# EAGLE design ESP32-TrackerREV3_PCBWAY (EAGLE 9.5.2)
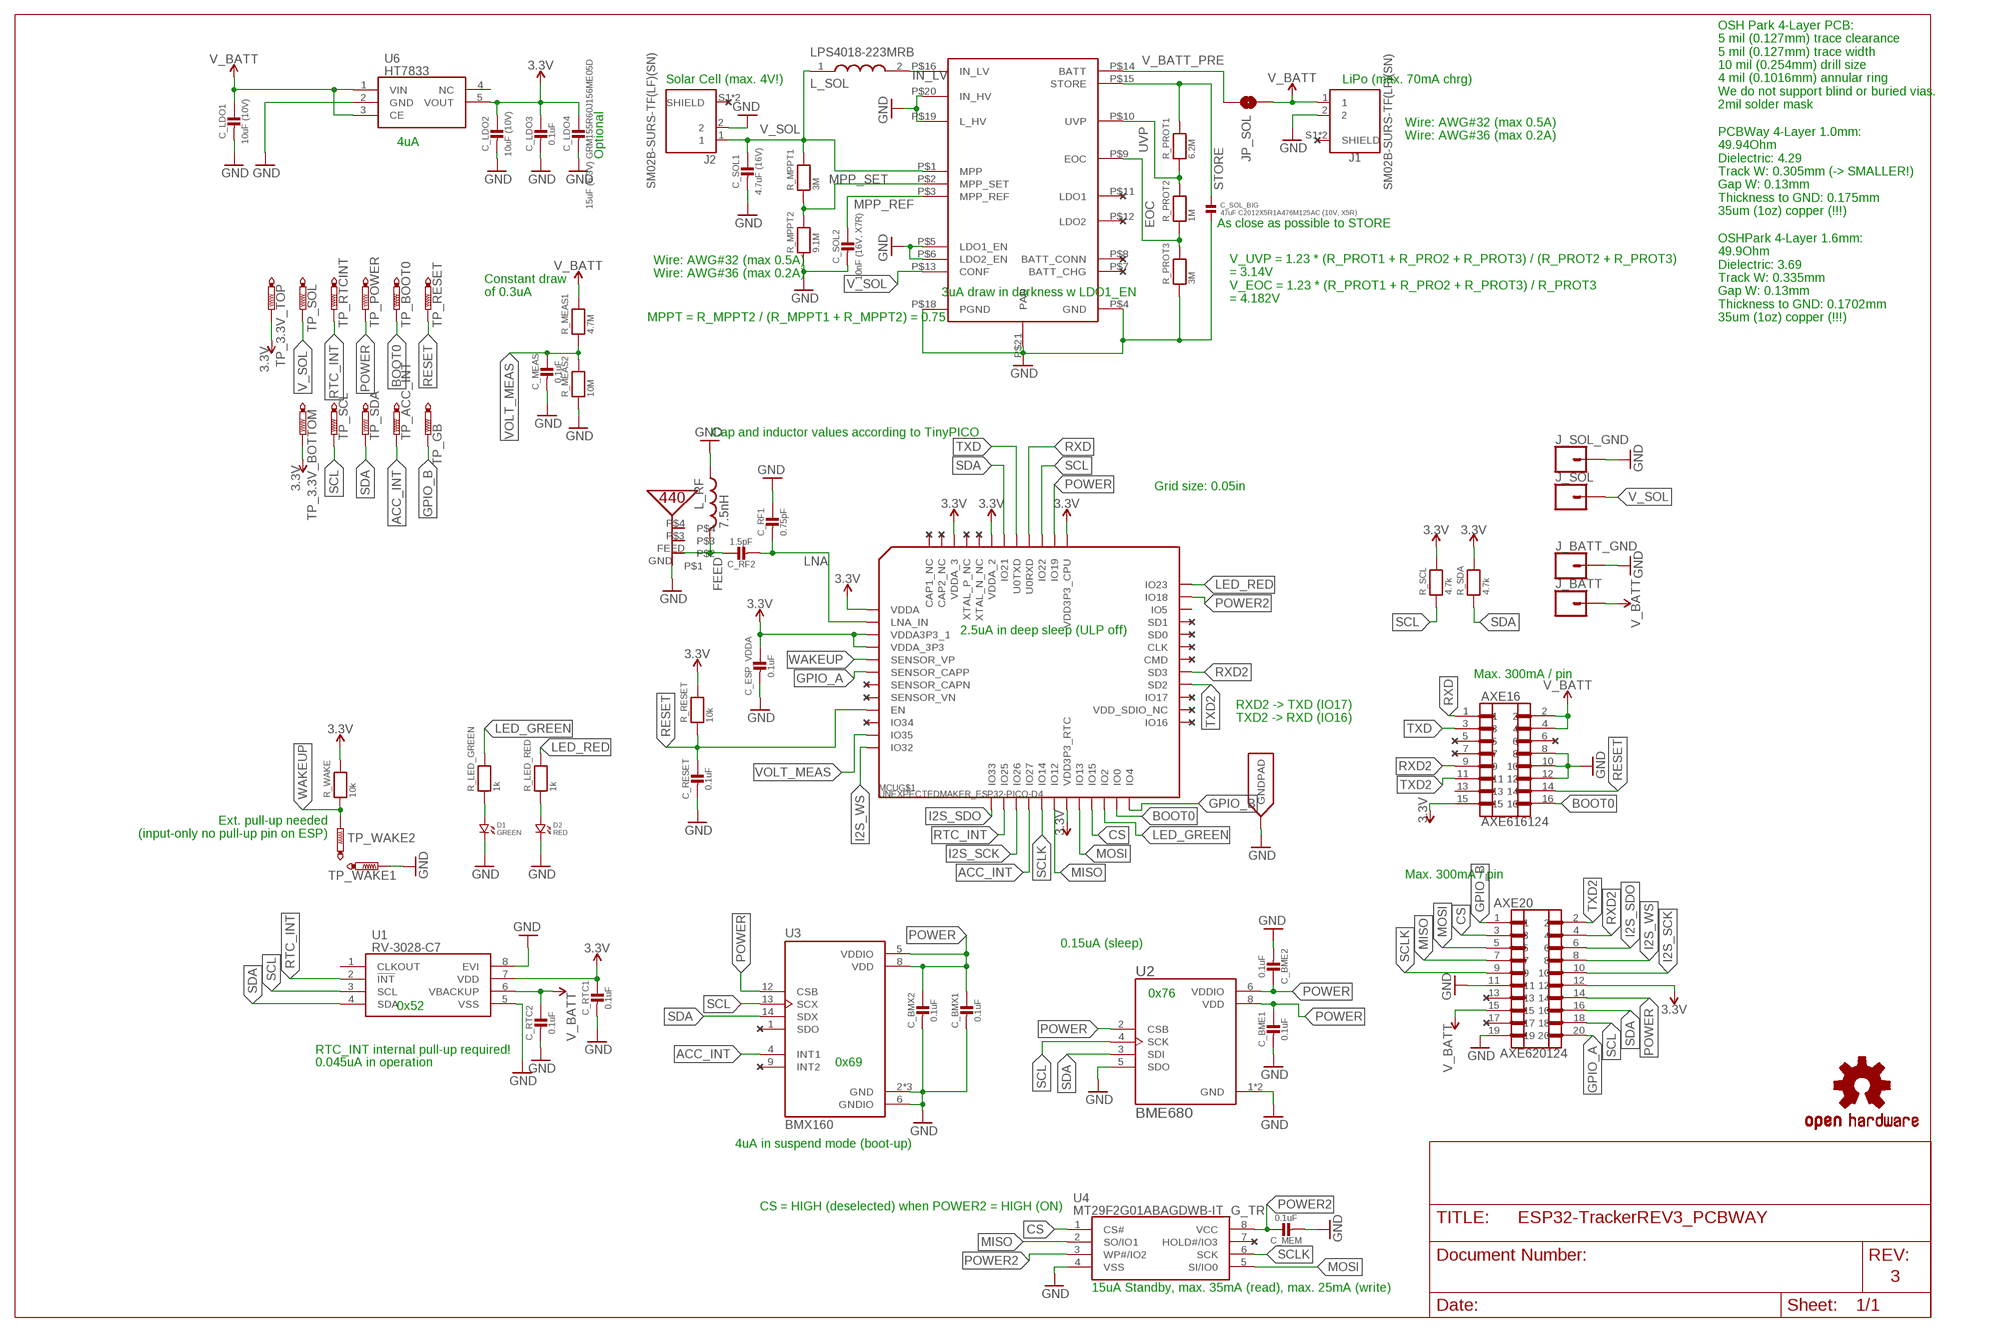
[diagram p0: schematic, sheet 1]

## Parts
ANT  UNEXPECTEDMAKER_PRO-OB-440  [UNEXPECTEDMAKER_PRO-OB-440]
AXE16  AXE616124  [AXE616124]
AXE20  AXE620124  [AXE620124]
C_BME1  0.1uF  MICROBUILDER_CAP_CERAMIC_0402MP  [MICROBUILDER__0402MP]
C_BME2  0.1uF  MICROBUILDER_CAP_CERAMIC_0402MP  [MICROBUILDER__0402MP]
C_BMX1  0.1uF  MICROBUILDER_CAP_CERAMIC_0402MP  [MICROBUILDER__0402MP]
C_BMX2  0.1uF  MICROBUILDER_CAP_CERAMIC_0402MP  [MICROBUILDER__0402MP]
C_ESP_VDDA  0.1uF  MICROBUILDER_CAP_CERAMIC_0402MP  [MICROBUILDER__0402MP]
C_LDO1  10uF (10V)  MICROBUILDER_CAP_CERAMIC_0402MP  [MICROBUILDER__0402MP]
C_LDO2  10uF (10V)  MICROBUILDER_CAP_CERAMIC_0402MP  [MICROBUILDER__0402MP]
C_LDO3  0.1uF  MICROBUILDER_CAP_CERAMIC_0402MP  [MICROBUILDER__0402MP]
C_LDO4  15uF (6.3V) GRM155R60J156ME05D  MICROBUILDER_CAP_CERAMIC_0402MP  [MICROBUILDER__0402MP]
C_MEAS  0.1uF  MICROBUILDER_CAP_CERAMIC_0402MP  [MICROBUILDER__0402MP]
C_MEM  0.1uF  MICROBUILDER_CAP_CERAMIC_0402MP  [MICROBUILDER__0402MP]
C_RESET  0.1uF  MICROBUILDER_CAP_CERAMIC_0402MP  [MICROBUILDER__0402MP]
C_RF1  0.75pF  MICROBUILDER_CAP_CERAMIC_0402MP  [MICROBUILDER__0402MP]
C_RF2  1.5pF  MICROBUILDER_CAP_CERAMIC_0402MP  [MICROBUILDER__0402MP]
C_RTC1  0.1uF  MICROBUILDER_CAP_CERAMIC_0402MP  [MICROBUILDER__0402MP]
C_RTC2  0.1uF  MICROBUILDER_CAP_CERAMIC_0402MP  [MICROBUILDER__0402MP]
C_SOL1  4.7uF (16V)  MICROBUILDER_CAP_CERAMIC_0402MP  [MICROBUILDER__0402MP]
C_SOL2  10nF (16V, X7R)  MICROBUILDER_CAP_CERAMIC_0402MP  [MICROBUILDER__0402MP]
C_SOL_BIG  47uF C2012X5R1A476M125AC (10V, X5R)  CAPACITOR.0805  [0805]
D1  GREEN  CMONR_STANDARDPARTS_LED.0402  [CMONR_STANDARDPARTS_0402.LED]
D2  RED  CMONR_STANDARDPARTS_LED.0402  [CMONR_STANDARDPARTS_0402.LED]
J1  SM02B-SURS-TF(LF)(SN)  [JST_SM02B-SURS-TF(LF)(SN)]
J2  SM02B-SURS-TF(LF)(SN)  [JST_SM02B-SURS-TF(LF)(SN)]
J_BATT  CONN_01PTH_NO_SILK_SMALL  [1X01_SMALL]
J_BATT_GND  CONN_01PTH_NO_SILK_SMALL  [1X01_SMALL]
J_SOL  CONN_01PTH_NO_SILK_SMALL  [1X01_SMALL]
J_SOL_GND  CONN_01PTH_NO_SILK_SMALL  [1X01_SMALL]
JP_SOL  JUMPER-SMT_2_NO_NO-SILK  [SMT-JUMPER_2_NO_NO-SILK]
L_RF  7.5nH  NORDIC_NRF_INDUCTOR_0402_N  [NORDIC_NRF_RESC0402_N]
L_SOL  LPS4018-223MRB  [LPS4018]
LOGO1  OSHW-LOGOS  [OSHW-LOGO-S]
MCU  UNEXPECTEDMAKER_ESP32-PICO-D4  [UNEXPECTEDMAKER_PICO-D4-QFN48]
R_LED_GREEN  1k  MICROBUILDER_RESISTOR_0402MP  [MICROBUILDER__0402MP]
R_LED_RED  1k  MICROBUILDER_RESISTOR_0402MP  [MICROBUILDER__0402MP]
R_MEAS1  4.7M  MICROBUILDER_RESISTOR_0402MP  [MICROBUILDER__0402MP]
R_MEAS2  10M  MICROBUILDER_RESISTOR_0402MP  [MICROBUILDER__0402MP]
R_MPPT1  3M  MICROBUILDER_RESISTOR_0402MP  [MICROBUILDER__0402MP]
R_MPPT2  9.1M  MICROBUILDER_RESISTOR_0402MP  [MICROBUILDER__0402MP]
R_PROT1  6.2M  MICROBUILDER_RESISTOR_0402MP  [MICROBUILDER__0402MP]
R_PROT2  1M  MICROBUILDER_RESISTOR_0402MP  [MICROBUILDER__0402MP]
R_PROT3  3M  MICROBUILDER_RESISTOR_0402MP  [MICROBUILDER__0402MP]
R_RESET  10k  MICROBUILDER_RESISTOR_0402MP  [MICROBUILDER__0402MP]
R_SCL  4.7k  MICROBUILDER_RESISTOR_0402MP  [MICROBUILDER__0402MP]
R_SDA  4.7k  MICROBUILDER_RESISTOR_0402MP  [MICROBUILDER__0402MP]
R_WAKE  10k  MICROBUILDER_RESISTOR_0402MP  [MICROBUILDER__0402MP]
TP_3.3V_BOTTOM  PTR1TP06SQ  [TP06SQ]
TP_3.3V_TOP  PTR1TP06SQ  [TP06SQ]
TP_ACC_INT  PTR1TP06SQ  [TP06SQ]
TP_BOOT0  PTR1TP06SQ  [TP06SQ]
TP_GB  PTR1TP06SQ  [TP06SQ]
TP_POWER  PTR1TP06SQ  [TP06SQ]
TP_RESET  PTR1TP06SQ  [TP06SQ]
TP_RTCINT  PTR1TP06SQ  [TP06SQ]
TP_SCL  PTR1TP06SQ  [TP06SQ]
TP_SDA  PTR1TP06SQ  [TP06SQ]
TP_SOL  PTR1TP06SQ  [TP06SQ]
TP_WAKE1  PTR1TP06SQ  [TP06SQ]
TP_WAKE2  PTR1TP06SQ  [TP06SQ]
U1  RV-3028-C7  [RV3028C7]
U2  BME680  [PSON80P300X300X100-8N]
U3  BMX160  [PQFN50P250X300X100-14N]
U4  MT29F2G01ABAGDWB-IT_G_TR  [SON127P800X600X65-8N]
U5  SPV1050  [SPV1050]
U6  HT7833  [SOT95P280X80-5N]

## Nets
3.3V: AXE16.15 AXE20.12 C_ESP_VDDA.1 C_LDO2.1 C_LDO3.1 C_LDO4.1 C_RTC1.1 MCU.1(VDDA) MCU.3(VDDA3P3_1) MCU.4(VDDA_3P3) MCU.19(VDD3P3_RTC) MCU.37(VDD3P3_CPU) MCU.43(VDDA_2) MCU.46(VDDA_3) R_RESET.2 R_SCL.2 R_SDA.2 R_WAKE.2 TP_3.3V_BOTTOM.TP TP_3.3V_TOP.TP U1.7(VDD) U6.5(VOUT)
ACC_INT: MCU.16(IO27) TP_ACC_INT.TP U3.4(INT1)
BOOT0: AXE16.16 MCU.23(IO0) TP_BOOT0.TP
CS: AXE20.3 MCU.21(IO15) U4.1(CS#)
EOC: R_PROT2.1 R_PROT3.2 U5.P$9(EOC)
FEED: ANT.FEED C_RF2.1 L_RF.2
GND: ANT.GND AXE16.8 AXE16.10 AXE16.12 AXE20.11 AXE20.19 C_BME1.2 C_BME2.2 C_BMX1.2 C_BMX2.2 C_ESP_VDDA.2 C_LDO1.2 C_LDO2.2 C_LDO3.2 C_LDO4.2 C_MEAS.2 C_MEM.2 C_RESET.2 C_RF1.1 C_RTC1.2 C_RTC2.2 C_SOL1.2 C_SOL2.2 C_SOL_BIG.2 D1.P$2 D2.P$2 J1.2 J2.2 J_BATT_GND.P$1 J_SOL_GND.P$1 L_RF.1 MCU.EXP(GNDPAD) R_MEAS2.1 R_MPPT2.1 R_PROT3.1 TP_WAKE1.TP U1.5(VSS) U1.8(EVI) U2.1(GND) U2.5(SDO) U2.7(GND) U3.2(GND) U3.3(GND) U3.6(GNDIO) U3.7(GND) U4.4(VSS) U5.P$4(GND) U5.P$5(LDO1_EN) U5.P$6(LDO2_EN) U5.P$18(PGND) U5.P$19(L_HV) U5.P$20(IN_HV) U5.P$21(PAD) U6.2(GND)
GPIO_A: AXE20.20 MCU.6(SENSOR_CAPP)
GPIO_B: AXE20.1 MCU.24(IO4) TP_GB.TP
I2S_SCK: AXE20.10 MCU.15(IO26)
I2S_SDO: AXE20.6 MCU.13(IO33)
I2S_WS: AXE20.8 MCU.12(IO32)
IN_LV: L_SOL.2 U5.P$16(IN_LV)
LED_GREEN: MCU.22(IO2) R_LED_GREEN.2
LED_RED: MCU.36(IO23) R_LED_RED.2
LNA: C_RF1.2 C_RF2.2 MCU.2(LNA_IN)
MISO: AXE20.7 MCU.18(IO12) U4.2(SO/IO1)
MOSI: AXE20.5 MCU.20(IO13) U4.5(SI/IO0)
MPP_REF: C_SOL2.1 U5.P$3(MPP_REF)
MPP_SET: R_MPPT1.1 R_MPPT2.2 U5.P$2(MPP_SET)
N$5: D1.P$1 R_LED_GREEN.1
N$6: D2.P$1 R_LED_RED.1
POWER: AXE20.14 C_BME1.1 C_BME2.1 C_BMX1.1 C_BMX2.1 MCU.38(IO19) TP_POWER.TP U2.2(CSB) U2.6(VDDIO) U2.8(VDD) U3.5(VDDIO) U3.8(VDD) U3.12(CSB)
POWER2: C_MEM.1 MCU.35(IO18) U4.3(WP#/IO2) U4.8(VCC)
RESET: AXE16.14 C_RESET.1 MCU.9(EN) R_RESET.1 TP_RESET.TP
RTC_INT: MCU.14(IO25) TP_RTCINT.TP U1.2(!INT)
RXD: AXE16.1 MCU.40(U0RXD)
RXD2: AXE16.9 AXE20.4 MCU.29(SD3)
SCL: AXE20.18 MCU.39(IO22) R_SCL.1 TP_SCL.TP U1.3(SCL) U2.4(SCK) U3.13(SCX)
SCLK: AXE20.9 MCU.17(IO14) U4.6(SCK)
SDA: AXE20.16 MCU.42(IO21) R_SDA.1 TP_SDA.TP U1.4(SDA) U2.3(SDI) U3.14(SDX)
STORE: C_SOL_BIG.1 R_PROT1.2 U5.P$15(STORE)
TXD: AXE16.3 MCU.41(U0TXD)
TXD2: AXE16.11 AXE20.2 MCU.28(SD2)
UVP: R_PROT1.1 R_PROT2.2 U5.P$10(UVP)
V_BATT: AXE16.2 AXE16.4 AXE20.15 C_LDO1.1 C_RTC2.1 J1.1 J_BATT.P$1 JP_SOL.2 R_MEAS1.2 U1.6(VBACKUP) U6.1(VIN) U6.3(CE)
V_BATT_PRE: JP_SOL.1 U5.P$14(BATT)
V_SOL: C_SOL1.1 J2.1 J_SOL.P$1 L_SOL.1 R_MPPT1.2 TP_SOL.TP U5.P$1(MPP) U5.P$13(CONF)
VOLT_MEAS: C_MEAS.1 MCU.11(IO35) R_MEAS1.1 R_MEAS2.2
WAKEUP: MCU.5(SENSOR_VP) R_WAKE.1 TP_WAKE2.TP
Unconnected: ANT.P$3 ANT.P$4 AXE16.5 AXE16.6 AXE16.7 AXE16.13 AXE20.13 AXE20.17 J1.S1(SHIELD) J1.S2(SHIELD) J2.S1(SHIELD) J2.S2(SHIELD) MCU.8(SENSOR_VN) MCU.10(IO34) MCU.25(IO16) MCU.26(VDD_SDIO_NC) MCU.27(IO17) MCU.30(CMD) MCU.31(CLK) MCU.32(SD0) MCU.33(SD1) MCU.34(IO5) MCU.44(XTAL_N_NC) MCU.45(XTAL_P_NC) MCU.47(CAP2_NC) MCU.48(CAP1_NC) U1.1(CLKOUT) U3.1(SDO) U3.9(INT2) U4.7(HOLD#/IO3) U5.P$7(BATT_CHG) U5.P$8(BATT_CONN) U5.P$11(LDO1) U5.P$12(LDO2) U6.4(NC)

## Notes on the sheet
- Solar Cell (max. 4V!) | LiPo (max. 70mA chrg)
- OSH Park 4-Layer PCB:
  5 mil (0.127mm) trace clearance
  5 mil (0.127mm) trace width
  10 mil (0.254mm) drill size
  4 mil (0.1016mm) annular ring
  We do not support blind or buried vias.
  2mil solder mask
- Wire: AWG#32 (max 0.5A)
  Wire: AWG#36 (max 0.2A)
- 4uA
- Optional
- PCBWay 4-Layer 1.0mm:
  49.94Ohm
  Dielectric: 4.29
  Track W: 0.305mm (-> SMALLER!)
  Gap W: 0.13mm
  Thickness to GND: 0.175mm
  35um (1oz) copper (!!!)
- As close as possible to STORE
- Wire: AWG#32 (max 0.5A)
  Wire: AWG#36 (max 0.2A)
- Constant draw
  of 0.3uA
- 3uA draw in darkness w LDO1_EN
- V_UVP = 1.23 * (R_PROT1 + R_PRO2 + R_PROT3) / (R_PROT2 + R_PROT3)
  = 3.14V
  V_EOC = 1.23 * (R_PROT1 + R_PRO2 + R_PROT3) / R_PROT3
  = 4.182V
- MPPT = R_MPPT2 / (R_MPPT1 + R_MPPT2) = 0.75
- OSHPark 4-Layer 1.6mm:
  49.9Ohm
  Dielectric: 3.69
  Track W: 0.335mm
  Gap W: 0.13mm
  Thickness to GND: 0.1702mm
  35um (1oz) copper (!!!)
- Cap and inductor values according to TinyPICO
- Grid size: 0.05in
- 2.5uA in deep sleep (ULP off)
- Max. 300mA / pin
- RXD2 -> TXD (IO17)
  TXD2 -> RXD (IO16)
- Ext. pull-up needed
  (input-only no pull-up pin on ESP)
- Max. 300mA / pin
- 0.15uA (sleep)
- 0x76
- 0x52
- RTC_INT internal pull-up required!
- 0.045uA in operation | 0x69
- 4uA in suspend mode (boot-up)
- CS = HIGH (deselected) when POWER2 = HIGH (ON)
- 3
- 15uA Standby, max. 35mA (read), max. 25mA (write)

## Power pins joined to a net without a drawn wire
SENSOR_CAPN: MCU.7(SENSOR_CAPN)

## Library data of the parts
ANT = TinyPICO:UNEXPECTEDMAKER_PRO-OB-440
AXE16 = PanasonicA4SConnectorsV7:AXE616124
AXE20 = PanasonicA4SConnectorsV7:AXE620124
C_BME1 C_BME2 C_BMX1 C_BMX2 C_ESP_VDDA C_LDO1-C_LDO4 C_MEAS C_MEM C_RESET C_RF1 C_RF2 C_RTC1 C_RTC2 C_SOL1 C_SOL2 = TinyPICO:MICROBUILDER_CAP_CERAMIC: Ceramic Capacitors For new designs, use the packages preceded by an '_' character since they are more reliable: The following footprints should be used on most boards: _0402 - Standard footprint for regular board layouts _0603 - Standard footprint for regular board layouts _0805 - Standard footprint for regular board layouts _1206 - Standard footprint for regular board layouts For extremely tight-pitch boards where space is at a premium, the following 'micro-pitch' footprints can be used (smaller pads, no silkscreen outline, etc.): _0402MP - Micro-pitch footprint for very dense/compact boards _0603MP - Micro-pitch footprint for very dense/compact boards _0805MP - Micro-pitch footprint for very dense/compact boards _1206MP - Micro-pitch footprint for very dense/compact boards
C_SOL_BIG = standardparts:CAPACITOR
D1 D2 = TinyPICO:CMONR_STANDARDPARTS_LED
J1 J2 = SM02B-SURS-TF_LF__SN_:SM02B-SURS-TF(LF)(SN): SUR Series 2 Position Single Row 0.8 mm Pitch Side Entry SMT Shrouded Header; DESCRIPTION: Connector Header Surface Mount, Right Angle 2 position 0.031 _0.80mm_; DIGI-KEY_PART_NUMBER: 455-2039-1-ND; DIGI-KEY_PURCHASE_URL: https://www.digikey.com/product-detail/en/jst-sales-america-inc/SM02B-SURS-TF_LF__SN_/455-2039-1-ND/1634927?utm_source=snapeda&utm_medium=aggregator&utm_campaign=symbol; MF: JST Sales; MP: SM02B-SURS-TF_LF__SN_; PACKAGE: None
J_BATT J_BATT_GND J_SOL J_SOL_GND = SparkFun-Connectors:CONN_01: Single connection point. Often used as Generic Header-pin footprint for 0.1 inch spaced/style header connections On any of the 0.1 inch spaced packages, you can populate with these: Break Away Headers - Straight <https://www.sparkfun.com/products/116> (PRT-00116) Break Away Male Headers - Right Angle <https://www.sparkfun.com/products/553> (PRT-00553) Female Headers <https://www.sparkfun.com/products/115> (PRT-00115) Break Away Headers - Machine Pin <https://www.sparkfun.com/products/117> (PRT-00117) Break Away Female Headers - Swiss Machine Pin <https://www.sparkfun.com/products/743> (PRT-00743) This device is also useful as a general connection point to wire up your design to another part of your project. Our various solder wires solder well into these plated through hole pads. Hook-Up Wire - Assortment (Stranded, 22 AWG) <https://www.sparkfun.com/products/11375> (PRT-11375) Hook-Up Wire - Assortment (Solid Core, 22 AWG) <https://www.sparkfun.com/products/11367> (PRT-11367) View the entire wire category on our website here <https://www.sparkfun.com/categories/141> Special notes: SMTSO-256-ET is a "flush mount" nut for a 4-40 screw. We mostly use this on specialty testbeds; it is a nice way to connect hardware to your PCB at an adjustable hieght. Also note, the SNAP packages are for using a snappable style connector. We sell a baggie of snaps and they are also used on two LilyPad designs: Snap Assortment - 30 pack (male and female) <https://www.sparkfun.com/products/11347> (DEV-11347) LilyPad Arduino SimpleSnap <https://www.sparkfun.com/products/10941> (DEV-10941) LilyPad SimpleSnap Protoboard <https://www.sparkfun.com/products/10940> (DEV-10940)
JP_SOL = SparkFun-Jumpers-NoCream:JUMPER-SMT_2_NO: Normally open jumper This jumper has two pads in close proximity to each other. Apply solder to close the connection. Round pads are easier to solder for beginners, but are a lot larger. SparkFun Product that uses the round pads: SparkFun EL Sequencer <https://www.sparkfun.com/products/12781>
L_RF = TinyPICO:NORDIC_NRF_INDUCTOR: Generic chip inductor
L_SOL = LPS4018-223MRB:LPS4018-223MRB: COILCRAFT - LPS4018-223MRB - INDUCTOR, SHLD, 22UH, 20%, 0.65A, SMD Source: Datasheet <http://www.coilcraft.com/pdfs/lps4018.pdf>; DESCRIPTION: COILCRAFT - LPS4018-223MRB - INDUCTOR, SHLD, 22UH, 20%, 0.65A, SMD; HEIGHT: mm; MANUFACTURER_NAME: COILCRAFT; MANUFACTURER_PART_NUMBER: LPS4018-223MRB; MOUSER_PART_NUMBER: 994-LPS4018-223MRB; MOUSER_PRICE-STOCK: https://www.mouser.co.uk/ProductDetail/Coilcraft/LPS4018-223MRB?qs=QQJxVsr8EGYUSn8mrv3X3Q%3D%3D
LOGO1 = SparkFun-Aesthetics:OSHW-LOGO: Open-Source Hardware (OSHW) Logo This logo indicates the piece of hardware it is found on incorporates a OSHW license and/or adheres to the definition of open source hardware found here: http://freedomdefined.org/OSHW
MCU = TinyPICOV2:UNEXPECTEDMAKER_ESP32-PICO-D4
R_LED_GREEN R_LED_RED R_MEAS1 R_MEAS2 R_MPPT1 R_MPPT2 R_PROT1-R_PROT3 R_RESET R_SCL R_SDA R_WAKE = TinyPICO:MICROBUILDER_RESISTOR: Resistors 0402 - 0402 Surface Mount Package 22 Ohm 1% 1/16W [Digikey: 311-22.0LRTR-ND] 33 Ohm 5% 1/16W 1.0K 5% 1/16W 1.5K 5% 1/16W 2.0K 1% 1/16W 10.0K 1% 1/16W [Digikey: 311-10.0KLRTR-ND] 10.0K 5% 1/16W [Digikey: RMCF0402JT10K0TR-ND] 12.1K 1% 1/16W [Digikey: 311-22.0LRTR-ND] 100.0K 5% 1/16W 0603 - 0603 Surface Mount Package 0 Ohm 1/10 Watt 1% Resistor 15 Ohm 1/10 Watt 1% Resistor 33 Ohm 1/10 Watt 1% Resistor 49.9 Ohm 1/10 Watt 1% Resistor 100 Ohm 1/10 Watt 1% Resistor 150 Ohm 1/10 Watt 1% Resistor 240 Ohm 1/10 Watt 1% Resistor 390 Ohm 1/10 Watt 1% Resistor 560 Ohm 1/10 Watt 1% Resistor 680 Ohm 1/10 Watt 1% Resistor 750 Ohm 1/10 Watt 1% Resistor 1.0K Ohm 1/10 Watt 1% Resistor 1.5K Ohm 1/10 Watt 1% Resistor 2.0K Ohm 1/10 Watt 1% Resistor 2.2K Ohm 1/10 Watt 1% Resistor 3.3K Ohm 1/10 Watt 1% Resistor 4.7K Ohm 1/10 Watt 1% Resistor 10.0K Ohm 1/10 Watt 1% Resistor 12.0K Ohm 1/10 Watt 1% Resistor 12.1K Ohm 1/10 Watt 1% Resistor 20.0K Ohm 1/10 Watt 1% Resistor 33.0K Ohm 1/10 Watt 1% Resistor 100.0K Ohm 1/10 Watt 1% Resistor 0805 - 0805 Surface Mount Package 0 Ohm 1/8 Watt 1% Resistor 33 Ohm 1/8 Watt 1% Resistor 100 Ohm 1/8 Watt 1% Resistor 150 Ohm 1/8 Watt 1% Resistor 200 Ohm 1/8 Watt 1% Resistor 240 Ohm 1/8 Watt 1% Resistor 330 Ohm 1/8 Watt 1% Resistor 390 Ohm 1/8 Watt 1% Resistor 470 Ohm 1/8 Watt 1% Resistor 1.0K Ohm 1/8 Watt 1% Resistor 1.5K Ohm 1/8 Watt 1% Resistor 2.0K Ohm 1/8 Watt 1% Resistor 4.7K Ohm 1/8 Watt 1% Resistor 5.1K Ohm 1/8 Watt 1% Resistor 5.6K Ohm 1/8 Watt 1% Resistor 10.0K Ohm 1/8 Watt 1% Resistor 22.0K Ohm 1/8 Watt 1% Resistor 33.0K Ohm 1/8 Watt 1% Resistor 100K Ohm 1/8 Watt 1% Resistor 1206 - 1206 Surface Mount Package 2012 - 2010 Surface Mount Package 0.11 Ohm 1/2 Watt 1% Resistor - Digikey: RHM.11UCT-ND
TP_3.3V_BOTTOM TP_3.3V_TOP TP_ACC_INT TP_BOOT0 TP_GB TP_POWER TP_RESET TP_RTCINT TP_SCL TP_SDA TP_SOL TP_WAKE1 TP_WAKE2 = testpad:PTR1: TEST PIN
U1 = RV-3028-C7:RV-3028-C7: Extreme Low Power RTC Module Source: Datasheet <http://www.microcrystal.com/images/_Product-Documentation/02_Oscillator_&_RTC_Modules/01_Datasheet/RV-3028-C7.pdf>; DESCRIPTION: Extreme Low Power RTC Module; HEIGHT: 0mm; MANUFACTURER_NAME: Micro Crystal AG; MANUFACTURER_PART_NUMBER: RV-3028-C7
U2 = BME680:BME680: Integrated Environmental Unit; DESCRIPTION: Gas, Humidity, Pressure, Temperature Sensor I²C, SPI Output; DIGI-KEY_PART_NUMBER: 828-1077-1-ND; DIGI-KEY_PURCHASE_URL: https://www.digikey.com/product-detail/en/bosch-sensortec/BME680/828-1077-1-ND/7401321?utm_source=snapeda&utm_medium=aggregator&utm_campaign=symbol; MF: Bosch Sensortec; MP: BME680; PACKAGE: LGA-8 Bosch Tools
U3 = BMX160NewV2:BMX160: IMU ACCEL/GYRO/MAG; AVAILABILITY: Unavailable; DESCRIPTION: Accelerometer, Gyroscope, Magnetometer, 9 Axis Sensor I²C, SPI Output; MF: Bosch Sensortec; MP: BMX160; PACKAGE: VFLGA-14 Bosch Sensortec; PRICE: None
U4 = MT29F2G01ABAGDWB-IT_G_TR:MT29F2G01ABAGDWB-IT_G_TR: IC FLASH 2G SPI 8UPDFN Source: Datasheet <https://www.arrow.com/en/products/mt29f2g01abagdwb-itgtr/micron-technology>; DESCRIPTION: IC FLASH 2G SPI 8UPDFN; HEIGHT: 0.65mm; MANUFACTURER_NAME: Micron; MANUFACTURER_PART_NUMBER: MT29F2G01ABAGDWB-IT:G TR; MOUSER_PART_NUMBER: 340-319922-REEL; MOUSER_PRICE-STOCK: https://www.mouser.co.uk/ProductDetail/Micron/MT29F2G01ABAGDWB-ITG-TR?qs=j%252B1pi9TdxUa99FyONPZPSg%3D%3D
U5 = STM-SPV1050_V2:SPV1050
U6 = HT7833:HT7833: Low Dropout Regulators(LDO) SOT-23-5 RoHS Source: Datasheet <https://datasheet.lcsc.com/szlcsc/1809291540_Holtek-Semicon-HT7833_C164106.pdf>; DESCRIPTION: Low Dropout Regulators(LDO) SOT-23-5 RoHS; HEIGHT: 0.8mm; MANUFACTURER_NAME: Holtek; MANUFACTURER_PART_NUMBER: HT7833

## Board
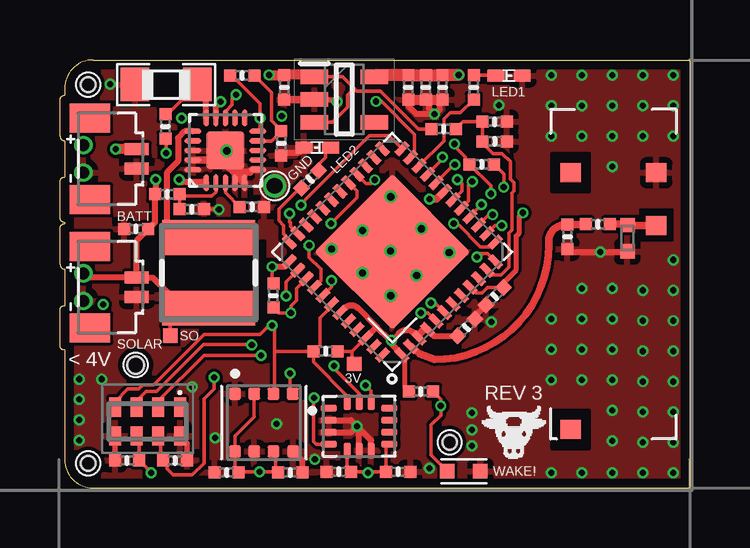
[diagram p1: board, top side]
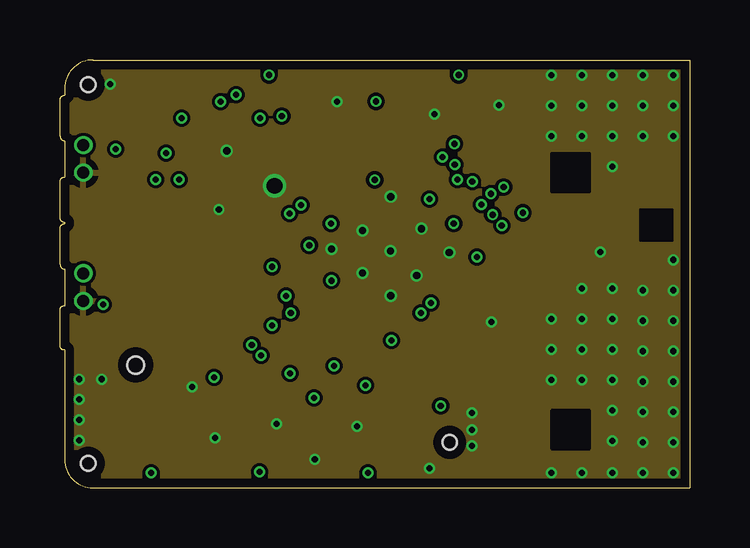
[diagram p2: board, inner layer GND]
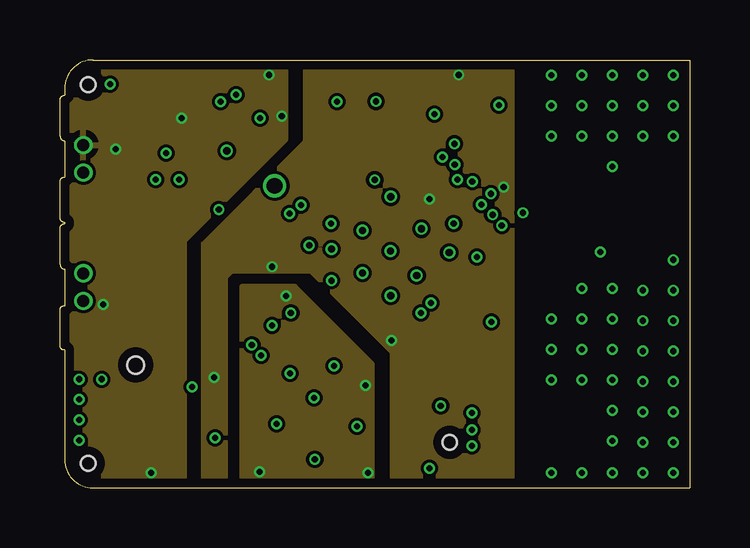
[diagram p3: board, inner layer 3.3V]
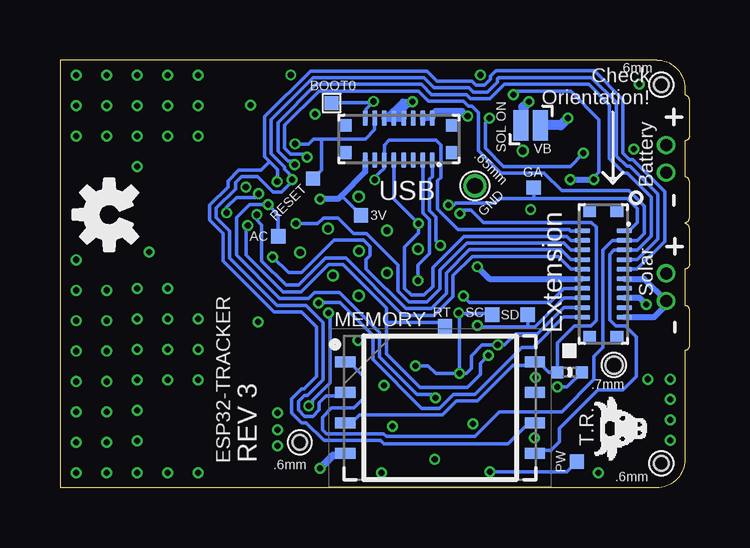
[diagram p4: board, bottom side, seen from below]

Size 26.25 x 17.85 mm. Coordinates in mm from the lower left corner, seen from the top.
Outline: 1.38,0 26.25,0 26.25,17.85 1.38,17.85 arc90 0.2,16.68 0.2,16.38 arc90 0,16.18 0,14.68 arc90 0.2,14.47 0.2,12.97 arc90 0,12.78 0,11.28 arc90 0.2,11.07 0.2,11.03 arc90 0,10.82 0,9.32 arc90 0.2,9.12 0.2,7.6 arc90 0,7.45 0,5.9 arc90 0.2,5.75 0.2,1.18 arc90 1.38,0
Copper layers (1+2*15+16): Top 0.0356mm / dielectric 0.1702mm / GND 0.0178mm / dielectric 47mil / 3.3V 0.0178mm / dielectric 0.1702mm / Bottom 0.0356mm
Design rules "ESP32-TrackerREV2-4LayerOSHPark": minimum track width 5mil, minimum drill 10mil, track to track 5mil, track to pad 5mil, pad to pad 5mil, via to via 5mil, smd to smd 5mil, copper to edge 15mil, drill to drill 6mil, minimum pad ring 4mil, minimum via ring 4mil, stop-mask expansion 0mil, vias tented up to drill 12mil, thermal gap 10mil
Holes 0.7 mm at 3.15,5.12
Holes 0.6 mm at 1.18,16.82 16.25,1.9 1.18,1.02

### Footprints (pad centres in the part's own frame; a part is rotated, then mirrored left to right if it is on the bottom)
UNEXPECTEDMAKER_PRO-OB-440 = smd 0.8 x 0.86: FEED 8.9,-4.4; GND 11.1,-4.4; P$3 11.1,-0.83; P$4 0.4,-0.83
AXE616124 = smd 0.2 x 0.65: 1 1.4,-0.88; 2 1.4,0.87; 3 1,-0.88; 4 1,0.87; 5 0.6,-0.88; 6 0.6,0.87; 7 0.2,-0.88; 8 0.2,0.87; 9 -0.2,-0.88; 10 -0.2,0.87; 11 -0.6,-0.88; 12 -0.6,0.87; 13 -1,-0.88; 14 -1,0.87; 15 -1.4,-0.88; 16 -1.4,0.87 | smd 0.45 x 0.53: DNC1 -2.2,0.57; DNC2 -2.2,-0.569; DNC3 2.197,-0.569; DNC4 2.197,0.57
AXE620124 = smd 0.2 x 0.65: 1 1.8,-0.88; 2 1.8,0.87; 3 1.4,-0.88; 4 1.4,0.87; 5 1,-0.88; 6 1,0.87; 7 0.6,-0.88; 8 0.6,0.87; 9 0.2,-0.88; 10 0.2,0.87; 11 -0.2,-0.88; 12 -0.2,0.87; 13 -0.6,-0.88; 14 -0.6,0.87; 15 -1,-0.88; 16 -1,0.87; 17 -1.4,-0.88; 18 -1.4,0.87; 19 -1.8,-0.88; 20 -1.8,0.87 | smd 0.45 x 0.53: DNC1 -2.6,0.57; DNC2 -2.6,-0.569; DNC3 2.597,-0.569; DNC4 2.597,0.57
MICROBUILDER__0402MP = smd 0.5 x 0.5: 1 -0.508,0; 2 0.508,0
0805 = smd 1.2 x 1.4: 1 -1.3,0; 2 1.3,0
CMONR_STANDARDPARTS_0402.LED = smd 0.7 x 0.5: P$1 -0.55,0; P$2 0.55,0
JST_SM02B-SURS-TF(LF)(SN) = smd 0.5 x 1: 1 -0.4,0; 2 0.4,0 | smd 1.2 x 1.7: S1 -1.7,-1.95; S2 1.7,-1.95
1X01_SMALL = drill 0.508: P$1 0,0
SMT-JUMPER_2_NO_NO-SILK = smd 0.635 x 1.27: 1 -0.406,0; 2 0.406,0
NORDIC_NRF_RESC0402_N = smd 0.6 x 0.6: 1 -0.55,0; 2 0.55,0
LPS4018 = smd 1.45 x 3.89: 1 -1.475,0; 2 1.475,0
UNEXPECTEDMAKER_PICO-D4-QFN48 = smd 0.66 x 0.3: 1 -3.327,2.75; 2 -3.327,2.25; 3 -3.327,1.75; 4 -3.327,1.25; 5 -3.327,0.75; 6 -3.327,0.25; 7 -3.327,-0.25; 8 -3.327,-0.75; 9 -3.327,-1.25; 10 -3.327,-1.75; 11 -3.327,-2.25; 12 -3.327,-2.75; 25 3.327,-2.75; 26 3.327,-2.25; 27 3.327,-1.75; 28 3.327,-1.25; 29 3.327,-0.75; 30 3.327,-0.25; 31 3.327,0.25; 32 3.327,0.75; 33 3.327,1.25; 34 3.327,1.75; 35 3.327,2.25; 36 3.327,2.75 | smd 0.3 x 0.66: 13 -2.75,-3.327; 14 -2.25,-3.327; 15 -1.75,-3.327; 16 -1.25,-3.327; 17 -0.75,-3.327; 18 -0.25,-3.327; 19 0.25,-3.327; 20 0.75,-3.327; 21 1.25,-3.327; 22 1.75,-3.327; 23 2.25,-3.327; 24 2.75,-3.327; 37 2.75,3.327; 38 2.25,3.327; 39 1.75,3.327; 40 1.25,3.327; 41 0.75,3.327; 42 0.25,3.327; 43 -0.25,3.327; 44 -0.75,3.327; 45 -1.25,3.327; 46 -1.75,3.327; 47 -2.25,3.327; 48 -2.75,3.327 | smd 4.572 x 4.572: EXP 0,0
TP06SQ = smd 0.6 x 0.6: TP 0,0
RV3028C7 = smd 0.5 x 0.8: 1 -1.35,-0.6; 2 -0.45,-0.6; 3 0.45,-0.6; 4 1.35,-0.6; 5 1.35,0.6; 6 0.45,0.6; 7 -0.45,0.6; 8 -1.35,0.6
PSON80P300X300X100-8N = smd 0.5 x 0.5: 1 1.2,1.2; 2 1.2,0.4; 3 1.2,-0.4; 4 1.2,-1.2; 5 -1.2,-1.22; 6 -1.2,-0.4; 7 -1.2,0.4; 8 -1.2,1.2
PQFN50P250X300X100-14N = smd 0.675 x 0.3: 1 -1.26,0.75; 2 -1.26,0.25; 3 -1.26,-0.25; 4 -1.26,-0.75; 8 1.26,-0.75; 9 1.26,-0.25; 10 1.26,0.25; 11 1.26,0.75 | smd 0.3 x 0.675: 5 -0.5,-1.01; 6 0,-1.01; 7 0.5,-1.01; 12 0.5,1.01; 13 0,1.01; 14 -0.5,1.01
SON127P800X600X65-8N = smd 0.85 x 0.45: 1 -3.95,1.905; 2 -3.95,0.635; 3 -3.95,-0.635; 4 -3.95,-1.905; 5 3.95,-1.905; 6 3.95,-0.635; 7 3.95,0.635; 8 3.95,1.905
SPV1050 = smd 0.7 x 0.2: P$1 -1.35,0.8; P$2 -1.35,0.4; P$3 -1.35,0; P$4 -1.35,-0.4; P$5 -1.35,-0.8; P$11 1.35,-0.8; P$12 1.35,-0.4; P$13 1.35,0; P$14 1.35,0.4; P$15 1.35,0.8 | smd 0.2 x 0.7: P$6 -0.8,-1.35; P$7 -0.4,-1.35; P$8 0,-1.35; P$9 0.4,-1.35; P$10 0.8,-1.35; P$16 0.8,1.35; P$17 0.4,1.35; P$18 0,1.35; P$19 -0.4,1.35; P$20 -0.8,1.35 | smd 1.6 x 1.6: P$21 0,0
SOT95P280X80-5N = smd 1.15 x 0.6: 1 -1.25,0.95; 2 -1.25,0; 3 -1.25,-0.95; 4 1.25,-0.95; 5 1.25,0.95

### Placement (x,y rotation side)
ANT  20.46,2.05 90 top
AXE16  12.12,14.55 0 bottom
AXE20  3.6,8.93 90 bottom
C_BME1  6.95,0.65 180 top
C_BME2  9.6,0.65 0 top
C_BMX1  11.62,0.68 180 top
C_BMX2  14.1,0.68 0 top
C_ESP_VDDA  16.94,6.7 45 top
C_LDO1  9.35,16.7 270 top
C_LDO2  15.25,16.7 270 top
C_LDO3  15.95,16.7 270 top
C_LDO4  14.52,16.7 270 top
C_MEAS  18.12,14.45 0 top
C_MEM  5,4.83 0 bottom
C_RESET  18.13,7.99 225 top
C_RF1  21.16,10.48 90 top
C_RF2  22.43,11 180 top
C_RTC1  4.8,1.15 0 top
C_RTC2  2.8,1.15 180 top
C_SOL1  3.18,10.8 180 top
C_SOL2  8,11.72 0 top
C_SOL_BIG  4.42,16.82 180 top
D1  18.72,17.2 0 top
D2  10.72,14.2 180 top
J1  3.2,13.72 270 top
J2  3.2,8.38 270 top
J_BATT  0.97,14.3 90 top
J_BATT_GND  0.97,13.15 90 top
J_SOL  0.97,8.95 90 top
J_SOL_GND  0.97,7.8 90 top
JP_SOL  6.62,15.12 0 bottom
L_RF  23.66,10.42 90 top
L_SOL  6.2,8.97 90 top
LOGO1  24.2,11.4 90 bottom
MCU  13.86,9.85 135 top
R_LED_GREEN  17.25,16.7 270 top
R_LED_RED  10.42,12.88 225 top
R_MEAS1  16,14.97 180 top
R_MEAS2  18.12,15.28 180 top
R_MPPT1  4.48,12.25 180 top
R_MPPT2  5.5,11.62 180 top
R_PROT1  4.4,15.07 90 top
R_PROT2  7.6,17.2 180 top
R_PROT3  9.22,14.38 90 top
R_RESET  17.59,13.49 0 top
R_SCL  8.9,8.03 90 top
R_SDA  11.07,5.7 0 top
R_WAKE  15.05,4.03 180 top
TP_3.3V_BOTTOM  13.7,11.38 0 bottom
TP_3.3V_TOP  12.27,5.17 0 top
TP_ACC_INT  17.15,10.5 0 bottom
TP_BOOT0  14.92,16.05 0 bottom
TP_GB  6.5,12.53 0 bottom
TP_POWER  4.7,1.1 0 bottom
TP_RESET  15.7,12.9 0 bottom
TP_RTCINT  10.2,6.75 0 bottom
TP_SCL  8.22,7.22 0 bottom
TP_SDA  6.75,7.22 0 bottom
TP_SOL  4.6,6.35 0 top
TP_WAKE1  17.52,0.7 0 top
TP_WAKE2  16.15,0.7 0 top
U1  3.65,2.77 180 top
U2  8.5,2.73 90 top
U3  12.47,2.58 0 top
U4  10.4,3.35 0 bottom
U5  6.9,14.07 90 top
U6  11.85,16.2 0 top

### Tracks (layer width: path | path; a pad name or v marks a point on that pad's centre or on a via)
3.3V  (via drill 0.25)
  Top 0.152: v18.5,12.55 18.5,13.09 R_RESET.2 | v6.43,4.62 6.43,4.14 6.01,3.72 6.01,1.04 5.52,0.55 4.73,0.55 4.47,0.81 4.47,0.97 C_RTC1.1 4.19,1.25 4.19,2.08 U1.7 | R_SCL.2 8.85,8.58 v8.85,9.22 | R_SDA.2 12.19,5.7 | 12.19,5.7 MCU.46 | TP_3.3V_TOP.TP 12.19,5.26 12.19,5.7 | v16.62,17.23 v16.62,17.22 | 13.16,17.21 U6.5
  Top 0.203: R_WAKE.2 14.37,4.19 14.37,5.44 MCU.1
  Top 0.254: MCU.4 15.6,6.34 C_ESP_VDDA.1 | MCU.1 14.02,5.79 14.02,5.8 13.82,6 v13.82,6.15 | v13.82,6.15 14.12,6.45 arc-90 14.78,6.45 MCU.3 | v13.82,6.15 13.77,6.15 13.2,6.72 | 13.2,6.72 12.42,7.5 arc90 11.86,7.5 MCU.43 | MCU.37 9.35,9.22 v8.85,9.22 | MCU.46 12.74,6.27 13.2,6.72
  Top 0.305: MCU.4 15.17,6.61 14.97,6.41 MCU.3 | v15.4,12.05 15.71,12.05 MCU.19
  Top 0.5: 13.16,17.21 C_LDO4.1 C_LDO2.1 C_LDO3.1 v16.62,17.22
  Bottom 0.152: TP_3.3V_BOTTOM.TP 14.5,12.18 14.5,12.2
  Bottom 0.254: v8.85,9.22 8.35,8.72 AXE20.12 | AXE16.15 13.52,13.18 14.5,12.2 14.65,12.05 v15.4,12.05
  pour 3.3V: 10.24,17.98 10.24,14.42 5.99,10.16 5.99,-0.12 6.88,-0.12 6.88,8.8 7.15,9.07 10.47,9.06 13.86,5.67 13.86,-0.14 18.85,-0.14 18.85,17.98
ACC_INT  (via drill 0.25)
  Top 0.152: v10.6,3.76 10.57,3.73 10.57,1.95 10.7,1.82 U3.4 | MCU.16 17.09,11.33 v17.57,11.82
  Bottom 0.152: v10.6,3.76 10.75,3.91 11.36,3.91 12.92,5.47 12.92,6.48 14.59,8.15 15.64,8.15 15.89,7.9 17.09,7.9 18.9,9.71 18.9,11.28 18.35,11.82 17.58,11.82 v17.57,11.82 17.15,11.39 TP_ACC_INT.TP
BOOT0  (via drill 0.25)
  Top 0.152: v13.17,16.12 13.4,16.12 14.79,14.73 14.79,14.04 14.62,13.87 MCU.23
  Bottom 0.152: AXE16.16 13.5,15.45 13.5,15.8 v13.17,16.12 13.22,16.07 14.9,16.07 TP_BOOT0.TP
CS  (via drill 0.25)
  Top 0.152: MCU.21 15.95,13.71 v15.95,13.8
  Bottom 0.152: v15.95,13.8 16.06,13.92 16.63,13.92 16.88,14.17 16.88,15.13 15.46,16.55 11.3,16.55 10.88,16.13 9.42,16.13 9.23,15.93 9.07,15.93 8.8,15.66 8.8,14.06 7.87,13.13 6.06,13.13 5.33,12.4 2.53,12.4 1.9,11.77 1.9,10.6 2.18,10.32 AXE20.3 3.21,10.32 3.61,9.93 3.61,5.86 3.98,5.49 3.98,4.53 5.33,3.18 7.92,3.18 8.96,2.14 12.64,2.14 12.76,2.26 15.13,2.26 15.3,2.43 15.3,2.95 14.92,3.33 13.99,3.33 13.57,3.75 13.57,4.63 14.2,5.25 U4.1
EOC
  Top 0.152: U5.P$9 8.82,14.47 R_PROT3.2 9.22,14.91 8.82,15.32 8.82,16.49 R_PROT2.1
FEED
  Top 0.305: C_RF2.1 23.63,11 L_RF.2 23.68,10.95 ANT.FEED
GND  (via drill 0.25, 0.3, 0.65)
  Top 0.152: C_ESP_VDDA.2 17.3,7.17 | R_MPPT2.1 6.61,11.62 v6.62,11.61
  Top 0.203: U6.2 11.48,16.2 v11.56,16.12 | C_RTC2.2 U1.5 | C_RTC1.2 5.31,1.87 U1.8
  Top 0.254: C_RF1.1 21.29,9.85 v22.52,9.85 23.64,9.85 L_RF.1 | 17.3,7.17 C_RESET.2 | v15.61,15.59 15.38,15.83 15.38,16.07 C_LDO2.2 | C_LDO3.2 15.82,16.07 15.82,15.78 15.63,15.59 v15.61,15.59 | C_BME2.2 10.11,1.14 U2.5 | 7.45,13.18 6.75,13.88 6.73,13.9 | D2.P$2 9.94,13.97 9.32,13.97 R_PROT3.1 | U3.2 12.13,2.83 v12.38,2.58 | U3.3 12.14,2.33 v12.38,2.58 | U3.6 12.47,2.48 v12.38,2.58 | U3.7 12.97,1.99 v12.38,2.58 | C_LDO4.2 14.52,15.93 14.86,15.59 v15.61,15.59
  Top 0.305: C_LDO1.2 U6.2 | U5.P$19 6.55,13.68 6.75,13.88 | 6.73,13.9 U5.P$21 6.9,13.53 U5.P$5 | U5.P$6 8.02,13.28 7.92,13.18 7.45,13.18
  Top 0.406: C_LDO4.2 C_LDO3.2
  Bottom 0.152: v5.51,4.21 5.11,4.21 C_MEM.2
  Bottom 0.254: AXE20.11 1.9,8.72 J_SOL_GND.P$1 0.97,7.62 1.47,7.12 AXE20.19 | 11.92,15.82 11.74,16 11.68,16 v11.56,16.12 11.95,16.12 12.65,15.42 AXE16.12 12.7,15.39 11.95,15.39 AXE16.8 11.92,15.82 | AXE16.10 11.92,15.82
  Bottom 0.305: U4.4 14.42,1.37 14.86,1.37 v15.41,0.82
  other vias: 20.49,0.62 21.76,0.62 23.03,0.62 24.3,0.62 25.57,0.62 23.03,1.97 24.3,1.89 25.57,1.89 23.03,3.24 24.3,3.16 25.57,3.16 23.03,4.51 24.3,4.43 25.57,4.43 21.76,4.51 20.49,4.51 13.78,9.88 15.08,10.81 16.23,9.82 14.87,8.85 13.79,8.02 12.61,8.97 11.33,9.96 12.61,10.73 13.79,12.14 23.03,5.78 24.3,5.7 25.57,5.7 21.76,5.78 20.49,5.78 23.03,7.05 24.3,6.97 25.57,6.97 21.76,7.05 20.49,7.05 23.03,8.32 24.3,8.24 25.57,8.24 21.76,8.32 25.57,9.51 23.03,13.4 20.49,14.67 21.76,14.67 23.03,14.67 24.3,14.67 25.57,14.67 20.49,15.94 21.76,15.94 23.03,15.94 24.3,15.94 25.57,15.94 20.49,17.21 21.76,17.21 23.03,17.21 24.3,17.21 25.57,17.21 18.31,15.97 17.19,1.75 17.19,2.42 17.19,3.12 9.04,2.67 17.99,6.93 0.81,1.99 0.81,2.84 0.81,3.69 6.46,2.09 6.95,14.06 0.81,4.54 8.95,12.6 2.09,16.84 10.62,1.2 1.74,4.54
  cutout Top: 22.09,13.95 20.5,13.95 20.5,12.36 22.09,12.36
  cutout GND: 25.53,11.61 24.21,11.61 24.21,10.31 25.53,10.31
  cutout GND: 22.09,3.23 20.5,3.23 20.5,1.64 22.09,1.64
  cutout Top: 22.09,3.23 20.5,3.23 20.5,1.64 22.09,1.64
  cutout Top: 25.53,11.61 24.21,11.61 24.21,10.31 25.53,10.31
  cutout GND: 22.09,13.95 20.5,13.95 20.5,12.36 22.09,12.36
  pour Top (isolate 0.13): 0.07,17.98 26.3,17.98 26.3,-0.12 0.07,-0.12
  pour GND: 0.07,17.98 26.3,17.98 26.3,-0.12 0.07,-0.12
  cutout Top: 4.2,7.67 8.52,7.67 8.52,10.3 4.2,10.3
GND1
  cutout Top: 3.7,16 5.17,16 5.17,17.68 3.7,17.68
GPIO_A  (via drill 0.25)
  Top 0.152: v15.46,7.72 15.63,7.72 MCU.6
  Bottom 0.152: v15.46,7.72 15.24,7.72 15.23,7.73 14.57,7.73 13.2,6.36 13.2,5.35 11.17,3.32 10.42,3.32 9.84,3.91 8.95,3.91 6.99,5.87 6.51,5.87 5.25,7.12 AXE20.20
GPIO_B  (via drill 0.25)
  Top 0.152: v10.05,11.8 10.05,11.84 12.91,14.7 13.71,14.7 MCU.24
  Bottom 0.152: AXE20.1 2.53,10.72 2.18,11.07 2.18,11.65 2.6,12.08 6.5,12.08 | v10.05,11.8 9.83,11.8 9.75,11.88 8.11,11.88 7.91,12.08 6.5,12.08 | TP_GB.TP 6.5,12.08
I2S_SCK  (via drill 0.25)
  Top 0.152: MCU.15 17.88,11.39 v18.04,11.39
  Bottom 0.152: v18.04,11.39 18.09,11.34 18.09,11.23 17.84,10.97 17.84,9.46 16.83,8.46 16.31,8.46 15.18,9.59 14.33,9.59 11.94,7.2 10.65,7.2 9.86,7.99 9.86,8.85 9.05,9.66 5.47,9.66 4.94,9.12 AXE20.10
I2S_SDO  (via drill 0.25)
  Top 0.152: MCU.13 18.15,10.24 17.97,10.06 17.53,10.06 16.57,11.02 v16.42,11.02
  Bottom 0.152: v16.42,11.02 15.51,11.02 15.26,11.27 14.66,11.27 14.02,10.62 13.48,10.62 12.16,9.3 12.16,8.78 12.16,8.21 11.71,7.76 10.95,7.76 10.42,8.29 10.42,9.09 9.29,10.22 5.24,10.22 4.95,9.93 AXE20.6
I2S_WS  (via drill 0.25)
  Top 0.152: v17.39,9.64 17.52,9.78 17.81,9.78 MCU.12
  Bottom 0.152: v17.39,9.64 16.73,8.98 16.18,8.98 14.82,10.34 13.59,10.34 13.32,10.07 13.32,9.7 13.48,9.54 13.48,9.14 11.82,7.48 10.77,7.48 10.14,8.11 10.14,8.97 9.17,9.94 5.36,9.94 4.94,9.53 AXE20.8
IN_LV
  Top 0.254: L_SOL.2 5.95,10.7 4.9,10.7 4.48,11.12 4.48,13.18 4.92,13.62 4.92,14.6 5.2,14.88 U5.P$16
LED_GREEN
  Top 0.152: MCU.22 16,14.46 16,15.38 16.27,15.65 16.71,15.65 R_LED_GREEN.2
LED_RED
  Top 0.152: MCU.36 9.56,10.36 9.33,10.59 9.33,10.94 9.12,11.15 9.12,11.62 10.02,12.52 R_LED_RED.2
LNA
  Top 0.152: MCU.2 14.64,5.9
  Top 0.305: 14.64,5.9 14.77,5.77 15.01,5.59 15.6,5.35 arc90 20.38,10.13 20.38,10.29 arc-90 21.06,10.97 21.08,10.99 C_RF1.2 21.91,10.99 C_RF2.2
MISO  (via drill 0.25)
  Top 0.152: MCU.18 16.75,12.38 16.75,12.69 v16.57,12.86
  Bottom 0.152: AXE20.7 2.18,9.53 1.32,10.39 1.32,12.25 2.49,13.41 2.62,13.41 3.05,13.85 3.05,16.08 4.08,17.11 7.96,17.11 8.01,17.06 8.01,16.93 8.43,16.51 9.02,16.51 9.19,16.69 10.65,16.69 11.07,17.11 15.69,17.11 17.44,15.36 17.44,13.94 16.89,13.39 16.89,13.31 16.57,12.99 v16.57,12.86 16.57,12.78 17.01,12.35 17.37,12.35 18,12.98 18.68,12.98 18.93,12.73 18.93,12.47 19.73,11.67 19.73,11.28 19.18,10.72 19.18,9.59 17.2,7.62 16,7.62 15.28,6.9 15.28,4.5 15.92,3.86 16.05,3.86 16.31,3.6 16.31,3.25 16.05,2.99 15.7,2.99 15.44,3.25 15.44,3.54 15.15,3.83 14.5,3.83 U4.2
MOSI  (via drill 0.25)
  Top 0.152: MCU.20 16.44,13.49 v16.46,13.49
  Bottom 0.152: v16.46,13.49 16.61,13.64 16.75,13.64 17.16,14.05 17.16,15.24 15.57,16.83 11.19,16.83 10.76,16.41 9.31,16.41 9.13,16.23 8.31,16.23 7.71,16.83 4.2,16.83 3.33,15.97 3.33,13.73 2.74,13.13 2.6,13.13 1.6,12.13 1.6,10.51 2.18,9.93 AXE20.5 3.15,9.93 3.33,9.74 3.33,7.01 3.08,6.75 2.68,6.75 2.22,6.29 2.22,4.66 2.79,4.09 3.83,4.09 5.42,2.49 5.42,1.93 5.78,1.57 6.33,1.57 U4.5
MPP_REF
  Top 0.152: C_SOL2.1 6.9,12.32 U5.P$3
MPP_SET
  Top 0.152: U5.P$2 6.5,12.35 6.33,12.17 5.01,12.17 | R_MPPT1.1 5.04,12.2 5.01,12.17 | R_MPPT2.2 4.99,12.15 5.01,12.17
N$5
  Top 0.152: R_LED_GREEN.1 D1.P$1
N$6
  Top 0.152: D2.P$1 11.07,14 11.07,13.78 10.78,13.48 R_LED_RED.1
POWER  (via drill 0.25)
  Top 0.152: U2.6 8.99,1.43 8.99,0.75 C_BME2.1 9.07,0.68 v8.32,0.68 7.46,0.68 C_BME1.1 7.3,0.81 U2.8 7.3,2.17 8.1,2.98 U2.2 | MCU.38 9.42,8.6 v9.42,8 | U3.5 11.97,0.83 C_BMX1.1 12.8,0.68 v12.85,0.62 12.9,0.68 C_BMX2.1 13.59,1.78 U3.8 | U3.12 12.97,4.05 v12.74,4.28
  Bottom 0.152: v9.42,8 9.17,7.74 5.82,7.74 5.24,8.32 AXE20.14 | TP_POWER.TP 5.12,0.68 v8.32,0.68
  pour 3.3V: 13.01,-0.12 13.01,5.16 9.79,8.38 7.6,8.38 7.6,-0.12
POWER2  (via drill 0.25)
  Top 0.152: MCU.35 9.61,10.91 9.61,11.06 9.58,11.09 v9.58,11.44
  Bottom 0.152: v9.58,11.44 9.42,11.6 9.12,11.6 8.59,11.07 4.09,11.07 3.89,10.87 3.89,6.98 4.11,6.76 4.8,6.76 5.51,6.05 C_MEM.1 5.86,4.83 6.29,5.25 U4.8 6.6,5.11 7.36,5.11 8.83,3.63 9.72,3.63 10.3,3.04 13.75,3.04 13.98,2.81 14.25,2.81 U4.3
RESET  (via drill 0.25)
  Top 0.152: MCU.9 17.34,8.12 17.6,8.12 17.83,8.35 C_RESET.1 | v17.97,12.27 17.97,12.61 R_RESET.1 16.91,13.67 16.91,13.79 16.45,14.25 v16.45,14.35
  Top 0.203: v19.3,11.47 19.15,11.33 19.15,10.64 19.03,10.51 19.03,9.1 18.48,8.55 C_RESET.1
  Bottom 0.152: v16.45,14.35 15.89,14.35 15.68,14.55 15.35,14.55 | v19.3,11.47 19.3,11.71 18.89,12.12 18.12,12.12 v17.97,12.27 | AXE16.14 13.13,14.94 13.52,14.55 15.35,14.55 | TP_RESET.TP 15.35,13.25 15.35,14.55
RTC_INT  (via drill 0.25)
  Top 0.152: MCU.14 18.14,10.94 v18.42,10.94 | v8.39,5.53 6,5.53 4.1,3.62 U1.2
  Bottom 0.152: v8.39,5.53 8.72,5.2 8.72,4.74 9.27,4.19 11.24,4.19 12.64,5.58 12.64,6.9 | v18.42,10.94 18.49,10.87 18.49,9.72 16.95,8.18 16.19,8.18 15.06,9.31 14.44,9.31 12.64,7.51 12.64,6.9 | TP_RTCINT.TP 10.35,6.9 12.64,6.9
RXD  (via drill 0.25)
  Top 0.152: MCU.40 10.89,8.65 10.89,9.12 10.39,9.62 v10.39,10.12
  Bottom 0.152: v10.39,10.12 10.57,10.29 10.57,11.3 10.84,11.57 10.84,12.88 10.71,13 10.71,13.66 AXE16.1
RXD2  (via drill 0.25)
  Top 0.152: v11.3,11.03 12.38,12.1 12.38,12.38 MCU.29
  Bottom 0.152: AXE20.4 4.95,10.32 5.12,10.49 9.4,10.49 10.69,9.2 10.69,8.41 11.07,8.04 11.59,8.04 11.88,8.32 11.88,10.05 11.3,10.63 v11.3,11.03 12.32,12.05 AXE16.9
SCL  (via drill 0.25)
  Top 0.152: v9.6,4.78 9.6,4.03 U2.4 | MCU.39 9.86,8.32 9.86,7.82 9.62,7.59 v9.62,7.3 9.12,7.3 R_SCL.1 | v11.43,5.09 11.43,4.98 12.47,3.94 U3.13 | v8,5.96 7.98,5.98 5.98,5.98 4.03,4.03 3.6,4.03 3.2,3.62 U1.3
  Bottom 0.152: AXE20.18 5.25,7.53 6.35,6.42 7.25,6.42 7.71,5.96 v8,5.96 8.65,5.96 9.1,5.51 9.1,4.98 9.3,4.78 v9.6,4.78 | v9.62,7.3 9.6,7.28 | 9.6,7.28 v9.6,4.78 | v9.6,4.78 10.57,4.78 10.9,5.1 v11.42,5.1 v11.43,5.09 | TP_SCL.TP 8.27,7.28 9.6,7.28
SCLK  (via drill 0.25)
  Top 0.152: MCU.17 17.04,11.97 17.04,12.63 v17.19,12.78
  Bottom 0.152: v17.19,12.78 17.19,13.01 17.18,13.02 17.18,13.28 17.54,13.64 | 17.54,13.64 17.72,13.82 17.72,15.48 15.8,17.39 10.96,17.39 10.53,16.97 9.08,16.97 8.9,16.79 8.55,16.79 8.29,17.05 8.29,17.18 8.07,17.39 3.97,17.39 2.78,16.2 2.78,13.96 2.5,13.69 2.37,13.69 1.04,12.37 1.04,10.27 2.19,9.12 AXE20.9 | U4.6 6.58,2.59 6.83,2.59 7.57,1.84 12.74,1.84 12.88,1.98 15.25,1.98 15.98,2.71 16.17,2.71 16.59,3.13 16.59,3.72 16.17,4.14 16.07,4.14 15.56,4.65 15.56,6.71 16.19,7.34 17.32,7.34 19.45,9.47 19.45,10.61 20.01,11.17 20.01,11.79 19.25,12.55 19.25,12.81 18.79,13.26 17.87,13.26 17.54,13.6 17.54,13.64
SDA  (via drill 0.25)
  Top 0.152: 8.95,5.7 8.95,6.73 8.9,6.73 v8.85,6.78 8.8,6.73 8.67,6.73 8.35,6.41 6.02,6.41 3.91,4.3 3.46,4.3 3.28,4.12 2.83,4.12 2.3,3.6 U1.4 | 8.95,5.7 8.95,3.98 U2.3 | MCU.42 11.33,7.57 10.84,7.08 10.84,5.97 R_SDA.1 | R_SDA.1 10.57,5.26 11.97,3.85 U3.14 | R_SDA.1 8.95,5.7
  Bottom 0.152: AXE20.16 5.25,7.92 6.45,6.72 6.73,6.72 | v8.85,6.78 8.79,6.72 6.73,6.72 | TP_SDA.TP 6.75,6.75 6.73,6.72
STORE
  Top 0.152: C_SOL_BIG.1 4.48,15.58 R_PROT1.2
  Top 0.254: U5.P$15 6.1,16.45 C_SOL_BIG.1
TXD  (via drill 0.25)
  Top 0.152: MCU.41 11.32,8.37 v11.32,8.64
  Bottom 0.152: v11.32,8.64 11.32,9.3 10.85,9.78 10.85,11.19 11.12,11.46 AXE16.3
TXD2  (via drill 0.25)
  Top 0.152: MCU.28 12.77,12.7 12.97,12.7 v13.12,12.85
  Bottom 0.152: AXE20.2 4.96,10.72 5.01,10.77 9.65,10.77 10.51,11.63 10.51,12.81 10.37,12.94 10.37,14.3 10.57,14.5 12.53,14.5 12.72,14.3 AXE16.11 12.75,13.64 12.75,13.32 12.93,13.14 13.12,12.95 v13.12,12.85
UVP  (via drill 0.25)
  Top 0.152: R_PROT1.1 4.42,14.54 v4.42,13.96 | U5.P$10 8.34,14.97 v8.34,15.43 8.34,16.03 7.17,17.2 R_PROT2.2
  Bottom 0.152: v4.42,13.96 4.97,13.41 7.75,13.41 8.52,14.18 8.52,15.24 v8.34,15.43
V_BATT  (via drill 0.25)
  Top 0.152: U6.1 11.77,17.15 12.27,16.65 | R_MEAS1.2 14.94,14.97 13.36,16.55 12.37,16.55 12.27,16.65 | 12.27,16.65 11.99,16.37 11.99,15.89 11.35,15.25 U6.3 | v3.8,0.62 3.8,0.66 C_RTC2.1 3.31,2.07 U1.6
  Top 0.305: 10.52,17.23 U6.1
  Top 0.406: 10.52,17.23 9.38,17.23 C_LDO1.1 9.33,17.23 v8.72,17.23 | J1.1 v2.33,14.12
  Bottom 0.254: v1.8,7.65 2.08,7.92 AXE20.15 | 10.72,15.54 AXE16.2 | AXE16.2 10.8,15.49 11.05,15.49 AXE16.4 11.12,15.52 11.02,15.42 AXE16.2
  Bottom 0.305: v9.25,15.5 9.33,15.58 9.38,15.58 9.5,15.7 10.57,15.7 10.72,15.54
  Bottom 0.406: v5.08,15.43 5.38,15.12 JP_SOL.2
  pour 3.3V: 9.4,17.98 0.07,17.98 0.07,-0.12 5.17,-0.12 5.17,10.32 9.4,14.55
V_BATT_PRE  (via drill 0.25)
  Top 0.254: U5.P$14 6.5,15.92 v6.7,16.12
  Bottom 0.406: v6.7,16.12 6.93,15.88 6.93,15.22 JP_SOL.1
V_SOL  (via drill 0.25)
  Top 0.152: TP_SOL.TP 4.6,7.9 4.67,7.97 | v7.34,16.4 7.18,16.24 7.18,15.98 6.9,15.7 U5.P$13
  Top 0.254: J2.1 1.15,8.78 J_SOL.P$1 | J2.1 3.87,8.78 4.67,7.97 5.14,7.5 L_SOL.1 | J2.1 3.2,10.32 C_SOL1.1 3.97,11.08 R_MPPT1.2 4,12.28 v4,12.87 | U5.P$1 6.08,12.75 5.29,12.75 5.08,12.75 v4.98,12.86
  Bottom 0.152: v7.34,16.4 7.19,16.55 4.96,16.55 3.78,15.37 3.78,13.18 4.1,12.86
  Bottom 0.254: v4.98,12.86 4.1,12.86 3.98,12.86 v4,12.87
VOLT_MEAS
  Top 0.152: R_MEAS1.1 16.81,15.28 R_MEAS2.2 C_MEAS.1 17.62,14.38 18.05,13.95 18.43,13.95 18.78,13.6 18.78,12.88 18.93,12.73 18.93,12.37 18.85,12.29 18.85,10.77 18.72,10.64 18.72,9.22 18.39,8.89 18,8.89 MCU.11
WAKEUP  (via drill 0.25)
  Top 0.152: MCU.5 15.34,7.3 v15.05,7.3 | R_WAKE.1 15.66,3.92 15.88,3.7 v15.88,3.42 15.88,3.02 15.47,2.62 15.47,1.38 TP_WAKE2.TP
  Bottom 0.152: v15.05,7.3 15,7.25 15,4.38 15.72,3.66 15.72,3.58 v15.88,3.42

### Text on the board
tNames: LED1 | GND | LED2 | BATT | SO | SOLAR | < 4V | 3V | REV 3 | WAKE!
bNames: .6mm | Check / Orientation! | BOOT0 | VB | SOL ON | .65mm | Battery | GA | USB | 3V | GND | RESET | AC | Solar | SC | RT | SD | MEMORY | Extension | .7mm | T.R. | PW | .6mm | .6mm | REV 3 | ESP32-TRACKER
tDocu: Ear-Tag Solar Cell | Ear-Tag Housing 22 x 35mm